# Altium project Elevador_V1I0.PrjPcb
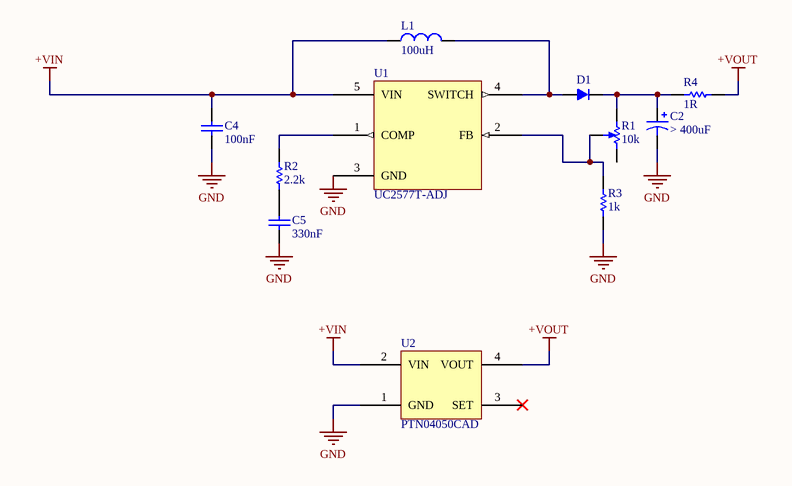
[diagram p0: Elevador.SchDoc]
Company: (c) 2014 CDR; Project: Fuente de Continua con LM723; VersionRevision: V1I1
1 sheet, 11 parts. Net scope: global (net labels, ports and power ports of the same name join across sheets).
Board file: Elevador_TH.PcbDoc

## Sheet Elevador.SchDoc
size A

### Parts
C2  > 400uF  [C 12.5 x 25]
C4  100nF  [C 1206]
C5  330nF  [C Lenteja]
D1  DIODO  [D 3528]  (value not drawn)
L1  100uH  [L SW TH]
R1  10k  [BOURNS-3596W]
R2  2.2k  [R THRU]
R3  1k  [R THRU]
R4  1R  [R 0805]
U1  UC2577T-ADJ  [TO220 5]
U2  PTN04050CAD  [PTN04050]

### Nets
+VIN: C4.2 L1.1 U1.5(VIN) U2.2(VIN)
+VOUT: R4.2 U2.4(VOUT)
GND: C2.2 C4.1 C5.1 R3.1 U1.3(GND) U2.1(GND)
NetC2_1: C2.1 D1.2(K) R1.1(CCW) R4.1
NetC5_2: C5.2 R2.1
NetD1_1: D1.1(A) L1.2 U1.4(SWITCH)
NetR1_2: R1.2(W) R3.2 U1.2(FB)
NetR2_2: R2.2 U1.1(COMP)

Not connected (* = marked no-connect by the designer): R1 3(CW); U2 3(SET)*

### Library data of the parts
C2 = C POL: Capacitor polarizado.; .Creator: SR; .PCBCheck: Used; .SCHCheck: Used
C4 C5 = C: Capacitor; .PCBCheck: Used; .Creator: SR; .SCHCheck: Used; Category: Capacitores
D1 = DIODO: .Creator: SR; .PCBCheck: SR; .SCHCheck: SR
L1 = L: Inductor
R1 = 3296W-1-502: TRIMMER 5K OHM 0.5W PC PIN; Manufacturer: Bourns Inc.; Power (Watts): 0.5W, 1/2W; Tolerance: ±10%; Temperature Coefficient: ±100ppm/°C; Number of Turns: 25; Adjustment Type: Top Adjustment; Resistive Material: Cermet; .Creator: SR; Supplier 1: Digi-Key; Manufacturer Part Number: 3296W-1-502; RoHS: RoHS non-compliant; Category: Potentiometers, Variable Resistors; Stock 1: 221; Pricing 1: 1=4.21, 10=3.683, 25=3.288, 50=3.0908, 100=3.025, 250=2.89344, 500=2.36736, 1000=2.03856, 2500=1.90704 (USD); Packaging: Tube; Resistance (Ohms): 5k; Mounting Type: Through Hole; Termination Style: PC Pin; Size / Dimension: Square - 0.375" L x 0.190" W x 0.395" H (9.53mm x 4.83mm x 10.03mm); ComponentLink1URL: http://www.bourns.com/data/global/pdfs/3296.pdf; ComponentLink1Description: http://www.bourns.com/data/global/pdfs/3296.pdf; Supplier Part Number 1: 3296W-502-ND; .PCBCheck: SR; .SCHCheck: SR
R2-R4 = R: Resistencia; .Creator: SR; .PCBCheck: Used; .SCHCheck: Used; Category: Resistencias
U1 = UC2577T-ADJ: IC REG MULTI CONFIG ADJ 3A TO220; Manufacturer: Texas Instruments; Output Type: Adjustable; Number of Outputs: 1; Voltage - Output: 5 V ~ 60 V; Voltage - Input: 3 V ~ 40 V; Frequency - Switching: 52kHz; Synchronous Rectifier: No; .Creator: SR; Supplier 1: Digi-Key; Manufacturer Part Number: UC2577T-ADJ; RoHS: RoHS Compliant; Category: Integrated Circuits (ICs); Stock 1: 667; Pricing 1: 1=21.94, 10=20.296, 25=18.6508, 100=17.3342, 250=15.90796, 500=15.13998, 750=14.59143, 1000=13.71375 (USD); Packaging: Tube; Type: Step-Up (Boost), Flyback, Forward Converter; Current - Output: 3A; Operating Temperature: -40°C ~ 125°C; Mounting Type: Through Hole; Package / Case: TO-220-5; Supplier Device Package: TO-220-5; ComponentLink1URL: http://www.ti.com/lit/ds/symlink/uc2577-adj.pdf; ComponentLink1Description: http://www.ti.com/lit/ds/symlink/uc2577-adj.pdf; Supplier Part Number 1: 296-11159-5-ND; .PCBCheck: SR; .SCHCheck: SR
U2 = PTN04050CAD: REG SW 5-15V 2.4A HORZ T/H; Manufacturer: Texas Instruments; Power (Watts) - Manufacture Series: 12W; Number of Outputs: 1; Voltage - Input (Min): 2.95V; Voltage - Input (Max): 5.5V; Voltage - Output 1: 5 ~ 15 V; Efficiency: 90%; .Creator: SR; Supplier 1: Digi-Key; Manufacturer Part Number: PTN04050CAD; RoHS: RoHS Compliant; Category: Power Supplies - Board Mount; Stock 1: 178; Pricing 1: 1=14.7, 5=14.59, 10=14.479, 50=13.8106, 100=12.474, 250=12.25124, 500=12.0285 (USD); Packaging: Tray; Type: Non-Isolated PoL Module; Voltage - Output 2: -; Voltage - Output 3: -; Current - Output (Max): 2.4A; Voltage - Isolation: -; Features: -; Mounting Type: Through Hole; Package / Case: 4-DIP Module; Size / Dimension: 0.87" L x 0.50" W x 0.34" H (22.1mm x 12.7mm x 8.6mm); Operating Temperature: -40°C ~ 85°C; Power (Watts) - Max: 12W; ComponentLink1URL: http://www.ti.com/lit/ds/symlink/ptn04050c.pdf; ComponentLink1Description: http://www.ti.com/lit/ds/symlink/ptn04050c.pdf; Supplier Part Number 1: 296-20498-ND; .PCBCheck: SR; .SCHCheck: SR